# EAGLE design quadripod_v3 (EAGLE 9.3.0)
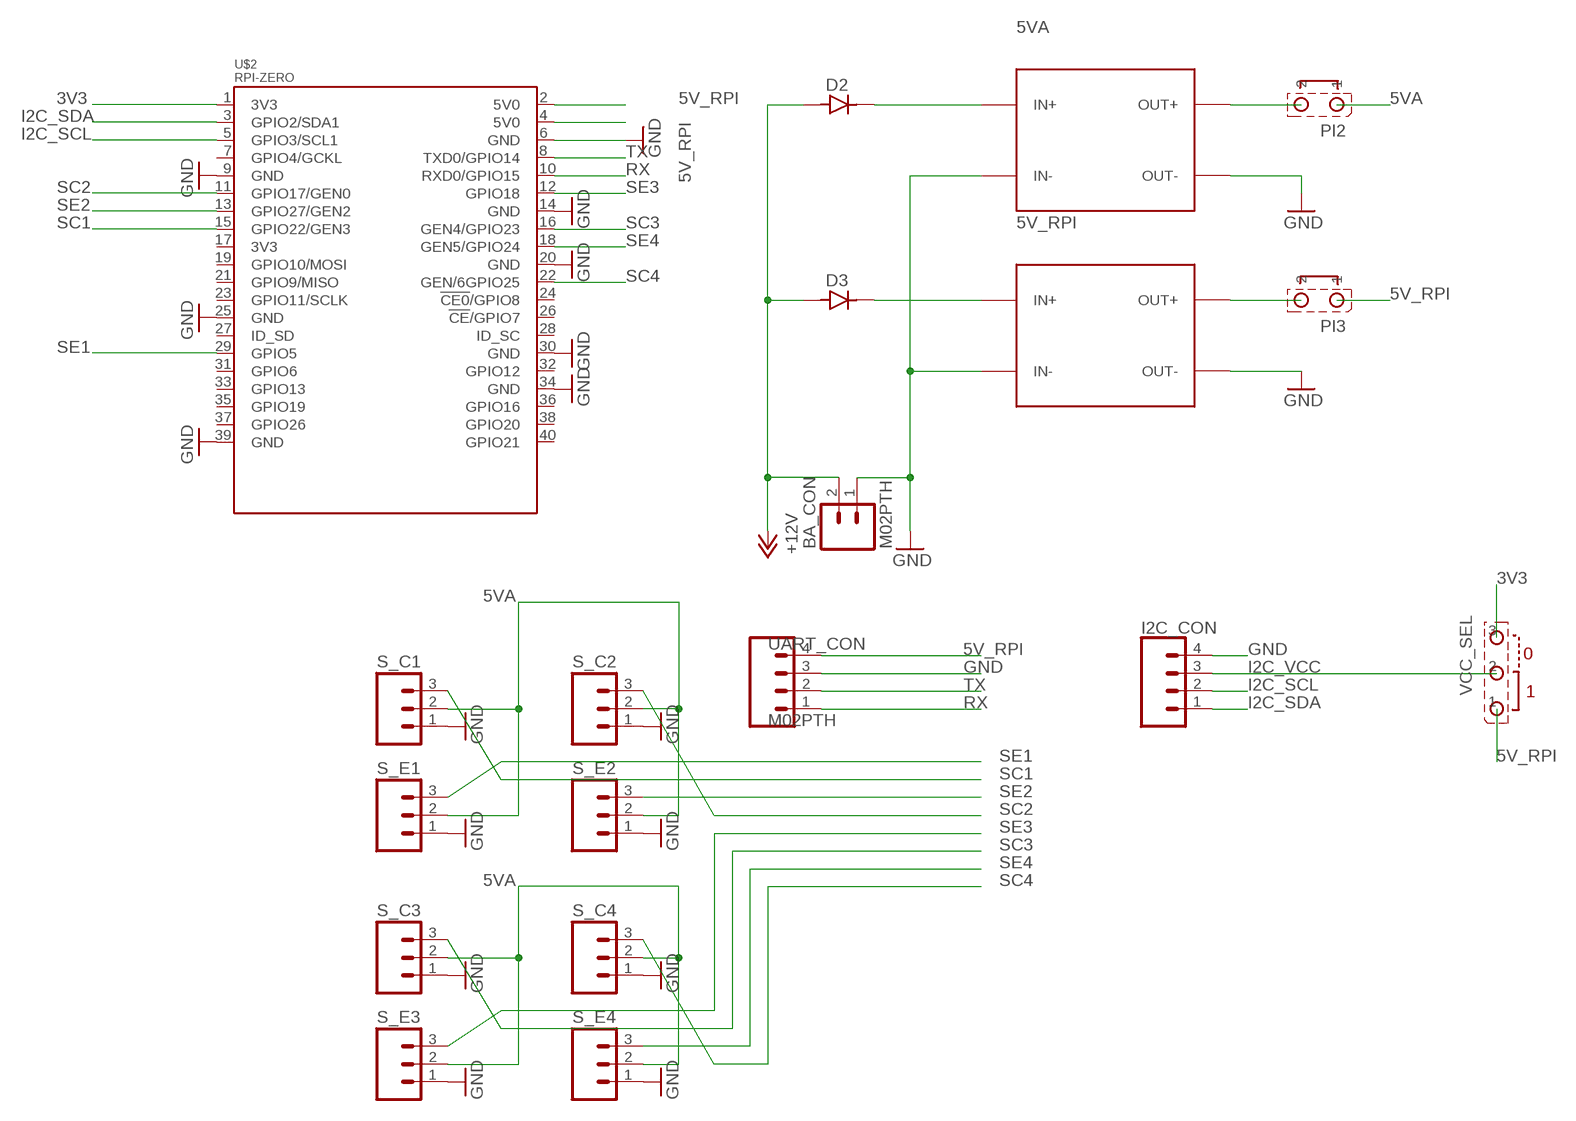
[diagram p0: schematic, sheet 1]

## Parts
5V_RPI  DC-DC-STEP-DOWN-LM2596  [DC-DC-STEP-DOWN-LM2596]
5VA  DC-DC-STEP-DOWN-LM2596  [DC-DC-STEP-DOWN-LM2596]
BA_CON  M02PTH  CONN_02PTH3  [1X02_LONGPADS]
D2  DIODES_DIODE/DO41  [DIODES_DO41]
D3  DIODES_DIODE/DO41  [DIODES_DO41]
I2C_CON  CONN_04LONGPADS  [1X04_LONGPADS]
PI2  STCMS_2  [STCMS_2]
PI3  STCMS_2  [STCMS_2]
S_C1  M03LONGPADS  [1X03_LONGPADS]
S_C2  M03LONGPADS  [1X03_LONGPADS]
S_C3  M03LONGPADS  [1X03_LONGPADS]
S_C4  M03LONGPADS  [1X03_LONGPADS]
S_E1  M03LONGPADS  [1X03_LONGPADS]
S_E2  M03LONGPADS  [1X03_LONGPADS]
S_E3  M03LONGPADS  [1X03_LONGPADS]
S_E4  M03LONGPADS  [1X03_LONGPADS]
U$2  RPI-ZERO  [RASPBERRYPI_BASTELSTUBE_V13_RASPI_BOARD_B+_FULL]
UART_CON  M02PTH  CONN_04LONGPADS  [1X04_LONGPADS]
VCC_SEL  STCMS_3/CMS  [STCMS_3]

## Nets
3V3 [5V_RPI]: U$2.1(3V3) VCC_SEL.3
5V_RPI [5V_RPI]: PI3.1 U$2.2(5V0) U$2.4(5V0) UART_CON.4 VCC_SEL.1
5VA [power]: PI2.1 S_C1.2 S_C2.2 S_C3.2 S_C4.2 S_E1.2 S_E2.2 S_E3.2 S_E4.2
+12V [power]: BA_CON.2 D2.A D3.A
GND [power]: 5V_RPI.IN- 5V_RPI.OUT- 5VA.IN- 5VA.OUT- BA_CON.1 I2C_CON.4 S_C1.1 S_C2.1 S_C3.1 S_C4.1 S_E1.1 S_E2.1 S_E3.1 S_E4.1 U$2.6(GND) U$2.9(GND) U$2.14(GND) U$2.20(GND) U$2.25(GND) U$2.30(GND) U$2.34(GND) U$2.39(GND) UART_CON.3
I2C_SCL: I2C_CON.2 U$2.5(GPIO3/SCL1)
I2C_SDA: I2C_CON.1 U$2.3(GPIO2/SDA1)
I2C_VCC [5V_RPI]: I2C_CON.3 VCC_SEL.2
N$3: 5VA.IN+ D2.K
N$4: 5V_RPI.IN+ D3.K
N$15: 5VA.OUT+ PI2.2
N$16 [5V_RPI]: 5V_RPI.OUT+ PI3.2
RX: U$2.10(RXD0/GPIO15) UART_CON.1
SC1: S_C1.3 U$2.15(GPIO22/GEN3)
SC2: S_C2.3 U$2.11(GPIO17/GEN0)
SC3: S_C3.3 U$2.16(GEN4/GPIO23)
SC4: S_C4.3 U$2.22(GEN/6GPIO25)
SE1: S_E1.3 U$2.29(GPIO5)
SE2: S_E2.3 U$2.13(GPIO27/GEN2)
SE3: S_E3.3 U$2.12(GPIO18)
SE4: S_E4.3 U$2.18(GEN5/GPIO24)
TX: U$2.8(TXD0/GPIO14) UART_CON.2
Unconnected: U$2.7(GPIO4/GCKL) U$2.17(3V3) U$2.19(GPIO10/MOSI) U$2.21(GPIO9/MISO) U$2.23(GPIO11/SCLK) U$2.24(!CE0!/GPIO8) U$2.26(!CE!/GPIO7) U$2.27(ID_SD) U$2.28(ID_SC) U$2.31(GPIO6) U$2.32(GPIO12) U$2.33(GPIO13) U$2.35(GPIO19) U$2.36(GPIO16) U$2.37(GPIO26) U$2.38(GPIO20) U$2.40(GPIO21)

## Library data of the parts
5V_RPI 5VA = diy-modules:DC-DC-STEP-DOWN-LM2596: DC/DC Step-Down Regulator based on LM2596-ADJ chip LM2596 datasheet available here: http://www.ti.com/lit/ds/symlink/lm2596.pdf Click here to find device on ebay.com <http://www.ebay.com/sch/lm2596+power+regulator>
BA_CON = SparkFun-Connectors:CONN_02: Multi connection point. Often used as Generic Header-pin footprint for 0.1 inch spaced/style header connections On any of the 0.1 inch spaced packages, you can populate with these: Break Away Headers - Straight <https://www.sparkfun.com/products/116> (PRT-00116) Break Away Male Headers - Right Angle <https://www.sparkfun.com/products/553> (PRT-00553) Female Headers <https://www.sparkfun.com/products/115> (PRT-00115) Break Away Headers - Machine Pin <https://www.sparkfun.com/products/117> (PRT-00117) Break Away Female Headers - Swiss Machine Pin <https://www.sparkfun.com/products/743> (PRT-00743) For SCREWTERMINALS and SPRING TERMINALS visit here: Screw Terimnals on SparkFun.com <https://www.sparkfun.com/search/results?term=Screw+Terminals> (5mm/3.5mm/2.54mm spacing) This device is also useful as a general connection point to wire up your design to another part of your project. Our various solder wires solder well into these plated through hole pads. Hook-Up Wire - Assortment (Stranded, 22 AWG) <https://www.sparkfun.com/products/11375> (PRT-11375) Hook-Up Wire - Assortment (Solid Core, 22 AWG) <https://www.sparkfun.com/products/11367> (PRT-11367) View the entire wire category on our website here <https://www.sparkfun.com/categories/141> Special notes: Molex polarized connector foot print use with: PRT-08233 with associated crimp pins and housings. 2.54_SCREWTERM for use with PRT-10571. 3.5mm Screw Terminal footprints for PRT-08084 5mm Screw Terminal footprints for use with PRT-08432
D2 D3 = 7robot:DIODES_DIODE: BAS32L => SOD80
I2C_CON UART_CON = SparkFun-Connectors:CONN_04: Multi connection point. Often used as Generic Header-pin footprint for 0.1 inch spaced/style header connections On any of the 0.1 inch spaced packages, you can populate with these: Break Away Headers - Straight <https://www.sparkfun.com/products/116> (PRT-00116) Break Away Male Headers - Right Angle <https://www.sparkfun.com/products/553> (PRT-00553) Female Headers <https://www.sparkfun.com/products/115> (PRT-00115) Break Away Headers - Machine Pin <https://www.sparkfun.com/products/117> (PRT-00117) Break Away Female Headers - Swiss Machine Pin <https://www.sparkfun.com/products/743> (PRT-00743) For SCREWTERMINALS and SPRING TERMINALS visit here: Screw Terimnals on SparkFun.com <https://www.sparkfun.com/search/results?term=Screw+Terminals> (5mm/3.5mm/2.54mm spacing) This device is also useful as a general connection point to wire up your design to another part of your project. Our various solder wires solder well into these plated through hole pads. Hook-Up Wire - Assortment (Stranded, 22 AWG) <https://www.sparkfun.com/products/11375> (PRT-11375) Hook-Up Wire - Assortment (Solid Core, 22 AWG) <https://www.sparkfun.com/products/11367> (PRT-11367) View the entire wire category on our website here <https://www.sparkfun.com/categories/141> Special notes: Molex polarized connector foot print use with SKU : PRT-08231 with associated crimp pins and housings. 1MM SMD Version SKU: PRT-10208; PROD_ID: CONN-09696
PI2 PI3 = 7robot:STCMS_2
S_C1-S_C4 S_E1-S_E4 = 7robot:M03: Header 3 Standard 3-pin 0.1" header. Use with straight break away headers (SKU : PRT-00116), right angle break away headers (PRT-00553), swiss pins (PRT-00743), machine pins (PRT-00117), and female headers (PRT-00115). Molex polarized connector foot print use with SKU : PRT-08232 with associated crimp pins and housings.
U$2 = RPI-Zero:RPI-ZERO
VCC_SEL = 7robot:STCMS_3

## Net classes
0 default: width 0.5 mm, drill 0.2 mm, clearance 0.25 mm
1 power: width 1 mm, drill 0.5 mm, clearance 0.5 mm
2 5V_RPI: width 1 mm, drill 0.5 mm, clearance 0.35 mm
3 signal: width 0.15 mm, drill 0.3 mm, clearance 0.006 mm

## Board
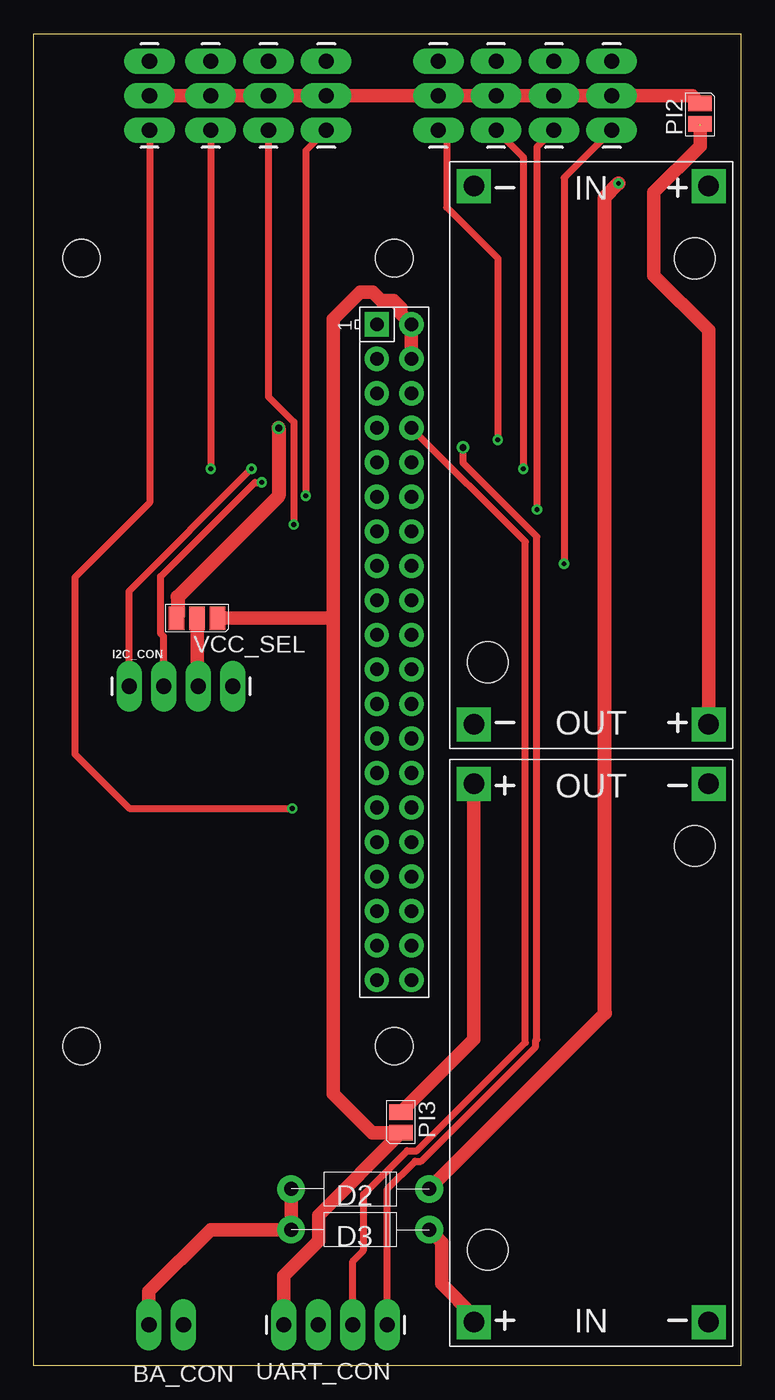
[diagram p1: board, top side]
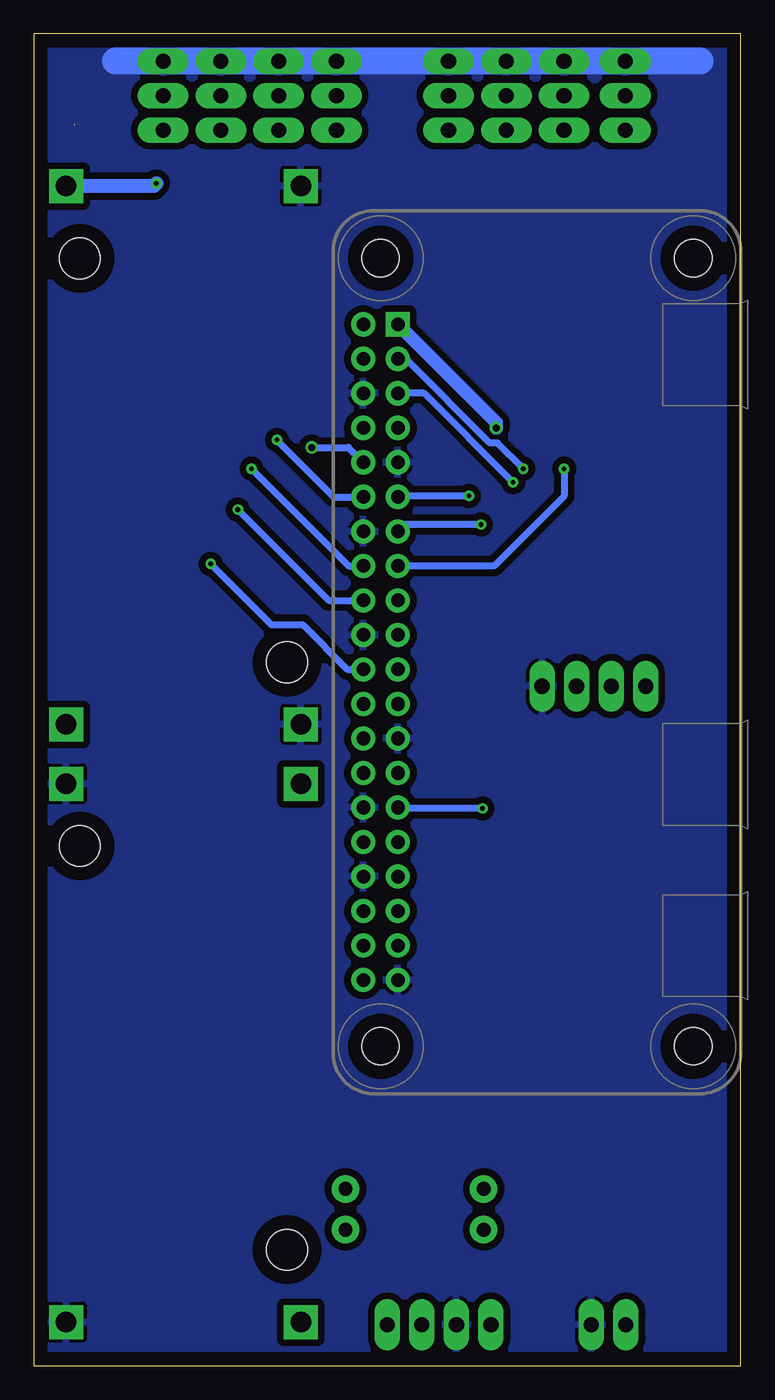
[diagram p2: board, bottom side, seen from below]

Size 52 x 98 mm. Coordinates in mm from the lower left corner, seen from the top.
Outline: 0,0 0,98 52,98 52,0 0,0
Copper layers (1*16): Top 0.035mm / dielectric 1.5mm / Bottom 0.035mm
Design rules "default": minimum track width 6mil, minimum drill 0.35mm, track to track 6mil, track to pad 6mil, pad to pad 6mil, via to via 6mil, smd to smd 6mil, copper to edge 40mil, drill to drill 6mil, minimum pad ring 10mil, minimum via ring 8mil, stop-mask expansion 4mil, vias tented up to drill 0mil, thermal gap 10mil

### Footprints (pad centres in the part's own frame; a part is rotated, then mirrored left to right if it is on the bottom)
DC-DC-STEP-DOWN-LM2596 = drill 1.5 pad 2.5 square: IN+ -19.812,8.636; IN- -19.812,-8.636; OUT+ 19.812,8.636; OUT- 19.812,-8.636 | hole 3: -14.478,7.62; 15.24,-7.62
1X02_LONGPADS = drill 1.118 pad 1.88 long: 1 0,0; 2 2.54,0
DIODES_DO41 = drill 1.016 pad 2.032: A 5.08,0; K -5.08,0
1X04_LONGPADS = drill 1.118 pad 1.88 long: 1 0,0; 2 2.54,0; 3 5.08,0; 4 7.62,0
STCMS_2 = smd 1.727 x 1.143: 1 0,-0.873; 2 0,0.635
1X03_LONGPADS = drill 1.118 pad 1.88 long: 1 0,0; 2 2.54,0; 3 5.08,0
RASPBERRYPI_BASTELSTUBE_V13_RASPI_BOARD_B+_FULL = drill 1 pad 1.778 square: 1 8.37,25.23 | drill 1 pad 1.778: 2 8.37,27.77; 3 10.91,25.23; 4 10.91,27.77; 5 13.45,25.23; 6 13.45,27.77; 7 15.99,25.23; 8 15.99,27.77; 9 18.53,25.23; 10 18.53,27.77; 11 21.07,25.23; 12 21.07,27.77; 13 23.61,25.23; 14 23.61,27.77; 15 26.15,25.23; 16 26.15,27.77; 17 28.69,25.23; 18 28.69,27.77; 19 31.23,25.23; 20 31.23,27.77; 21 33.77,25.23; 22 33.77,27.77; 23 36.31,25.23; 24 36.31,27.77; 25 38.85,25.23; 26 38.85,27.77; 27 41.39,25.23; 28 41.39,27.77; 29 43.93,25.23; 30 43.93,27.77; 31 46.47,25.23; 32 46.47,27.77; 33 49.01,25.23; 34 49.01,27.77; 35 51.55,25.23; 36 51.55,27.77; 37 54.09,25.23; 38 54.09,27.77; 39 56.63,25.23; 40 56.63,27.77 | hole 2.75: 3.5,3.5; 3.5,26.5; 61.5,3.5; 61.5,26.5
STCMS_3 = smd 1.727 x 1.143: 1 0,-1.508; 2 0,0; 3 0,1.508

### Placement (x,y rotation side)
5V_RPI  41,23 90 top
5VA  41,67 270 top
BA_CON  11,3 0 bottom
D2  24,13 180 top
D3  24,10 180 top
I2C_CON  7,50 0 top
PI2  49,92 180 top
PI3  27,18 0 top
S_C1  13,96 270 top
S_C2  21.5,96 270 top
S_C3  34,96 270 top
S_C4  42.5,96 270 top
S_E1  8.5,96 270 top
S_E2  17.25,96 270 top
S_E3  29.75,96 270 top
S_E4  38.25,96 270 top
U$2  0,85 270 top
UART_CON  26,3 180 top
VCC_SEL  12,55 90 top

### Tracks (layer width: path | path; a pad name or v marks a point on that pad's centre or on a via)
3V3  (via drill 0.5)
  Top 1: 10.58,56.22 10.58,55.09 VCC_SEL.3
  Top 1.016: v18,69 18,64 10.57,56.57 10.57,55.08 VCC_SEL.3
  Bottom 1: U$2.1 18,69.4 v18,69
5V_RPI
  Top 1: UART_CON.4 18.38,6.61 20.94,9.16 20.94,11.06 PI3.1 24.87,17.13 22,20 22,55 | 22,55 22,77 24,79 24.91,79 25.54,78.37 26.47,78.37 26.97,77.87 26.97,77.43 U$2.2 U$2.4 | VCC_SEL.1 22,55
5VA
  Top 1: 48.94,92.94 48.41,93.46 S_C4.2 S_E4.2 S_C3.2 S_E3.2 S_C2.2 S_E2.2 S_C1.2 S_E1.2 | 48.94,92.94 49,92.94 | PI2.1 48.94,92.94
+12V
  Top 1: BA_CON.2 8.46,5.46 13,10 D3.A D2.A
GND
  Bottom 2: 3,96 46,96
  pour Bottom: -2,-2 -2,100 54,100 54,-2
I2C_SCL  (via drill 0.35)
  Top 0.5: I2C_CON.2 9.54,53.67 9.32,53.89 9.32,58.07 16.25,65 v16.75,65
  Bottom 0.5: v16.75,65 23.3,71.55 U$2.5
I2C_SDA  (via drill 0.35)
  Top 0.5: I2C_CON.1 7,57 v16,66
  Bottom 0.5: v16,66 17.9,67.9 18.46,67.9 24.65,74.09 U$2.3
I2C_VCC
  Top 1: VCC_SEL.2 12,50.08 I2C_CON.3
N$3  (via drill 0.35)
  Top 1: D2.K 42,25.92
  Top 1.016: 42,25.92 42,86 v43,87
  Bottom 1.016: v43,87 43.19,86.81 5VA.IN+
N$4
  Top 1: D3.K 30,9.08 30,6 32.36,3.64 5V_RPI.IN+
N$15  (1 unrouted)
  Top 1: 5VA.OUT+ 49.64,76.2 45.6,80.23 45.6,86.34 49,89.74 49,91.3
N$16
  Top 1: 5V_RPI.OUT+ 32.36,24 PI3.2
RX  (via drill 0.5)
  Top 0.508: UART_CON.1 26,13 28.04,15.04 28.49,15.04 36.91,23.46 36.91,23.91 37,24 37,61 31.57,66.43 v31.57,67.57
  Bottom 0.508: v31.57,67.57 28.87,67.57 U$2.10
SC1  (via drill 0.35)
  Top 0.5: S_C1.3 v13,66
  Bottom 0.5: v13,66 13,64 18.15,58.85 U$2.15
SC2  (via drill 0.35)
  Top 0.5: v20,64 20,89.42 S_C2.3
  Bottom 0.5: v20,64 25.16,64 U$2.11
SC3  (via drill 0.35)
  Top 0.5: S_C3.3 36,88.92 v36,66
  Bottom 0.5: v36,66 28.85,58.85 U$2.16
SC4  (via drill 0.35)
  Top 0.5: S_C4.3 39,87.42 v39,59
  Bottom 0.5: v39,59 34.53,54.53 32.23,54.53 28.94,51.23 U$2.22
SE1  (via drill 0.35)
  Top 0.5: 8,90.42 S_E1.3 8.5,63.5 3,58 3,45 7,41 v19,41
  Bottom 0.5: v19,41 25.16,41 U$2.29
SE2  (via drill 0.35)
  Top 0.5: S_E2.3 17.25,71.31 19.11,69.44 v19.11,61.89
  Bottom 0.5: v19.11,61.89 24.73,61.89 U$2.13
SE3  (via drill 0.35)
  Top 0.5: S_E3.3 30.36,90.31 30.36,85.25 34.12,81.49 v34.12,68.12
  Bottom 0.5: v34.12,68.12 29.93,63.93 U$2.12
SE4  (via drill 0.35)
  Top 0.5: S_E4.3 37,89.67 v37,63
  Bottom 0.5: v37,63 30.31,56.31 U$2.18
TX
  Top 0.508: UART_CON.2 23.46,7.69 24.25,8.48 24.25,12.61 27.45,15.8 28.18,15.8 36.15,23.77 36.15,60.63 U$2.8

### Text on the board
tDocu: 3v3 | 5v | sda | scl | Vcc | gnd | Thib-s / v3.0 Rev A | Vin | gnd | 5v | gnd | tx | rx